# EAGLE design TeensyViewTopTest (EAGLE 7.5.0)
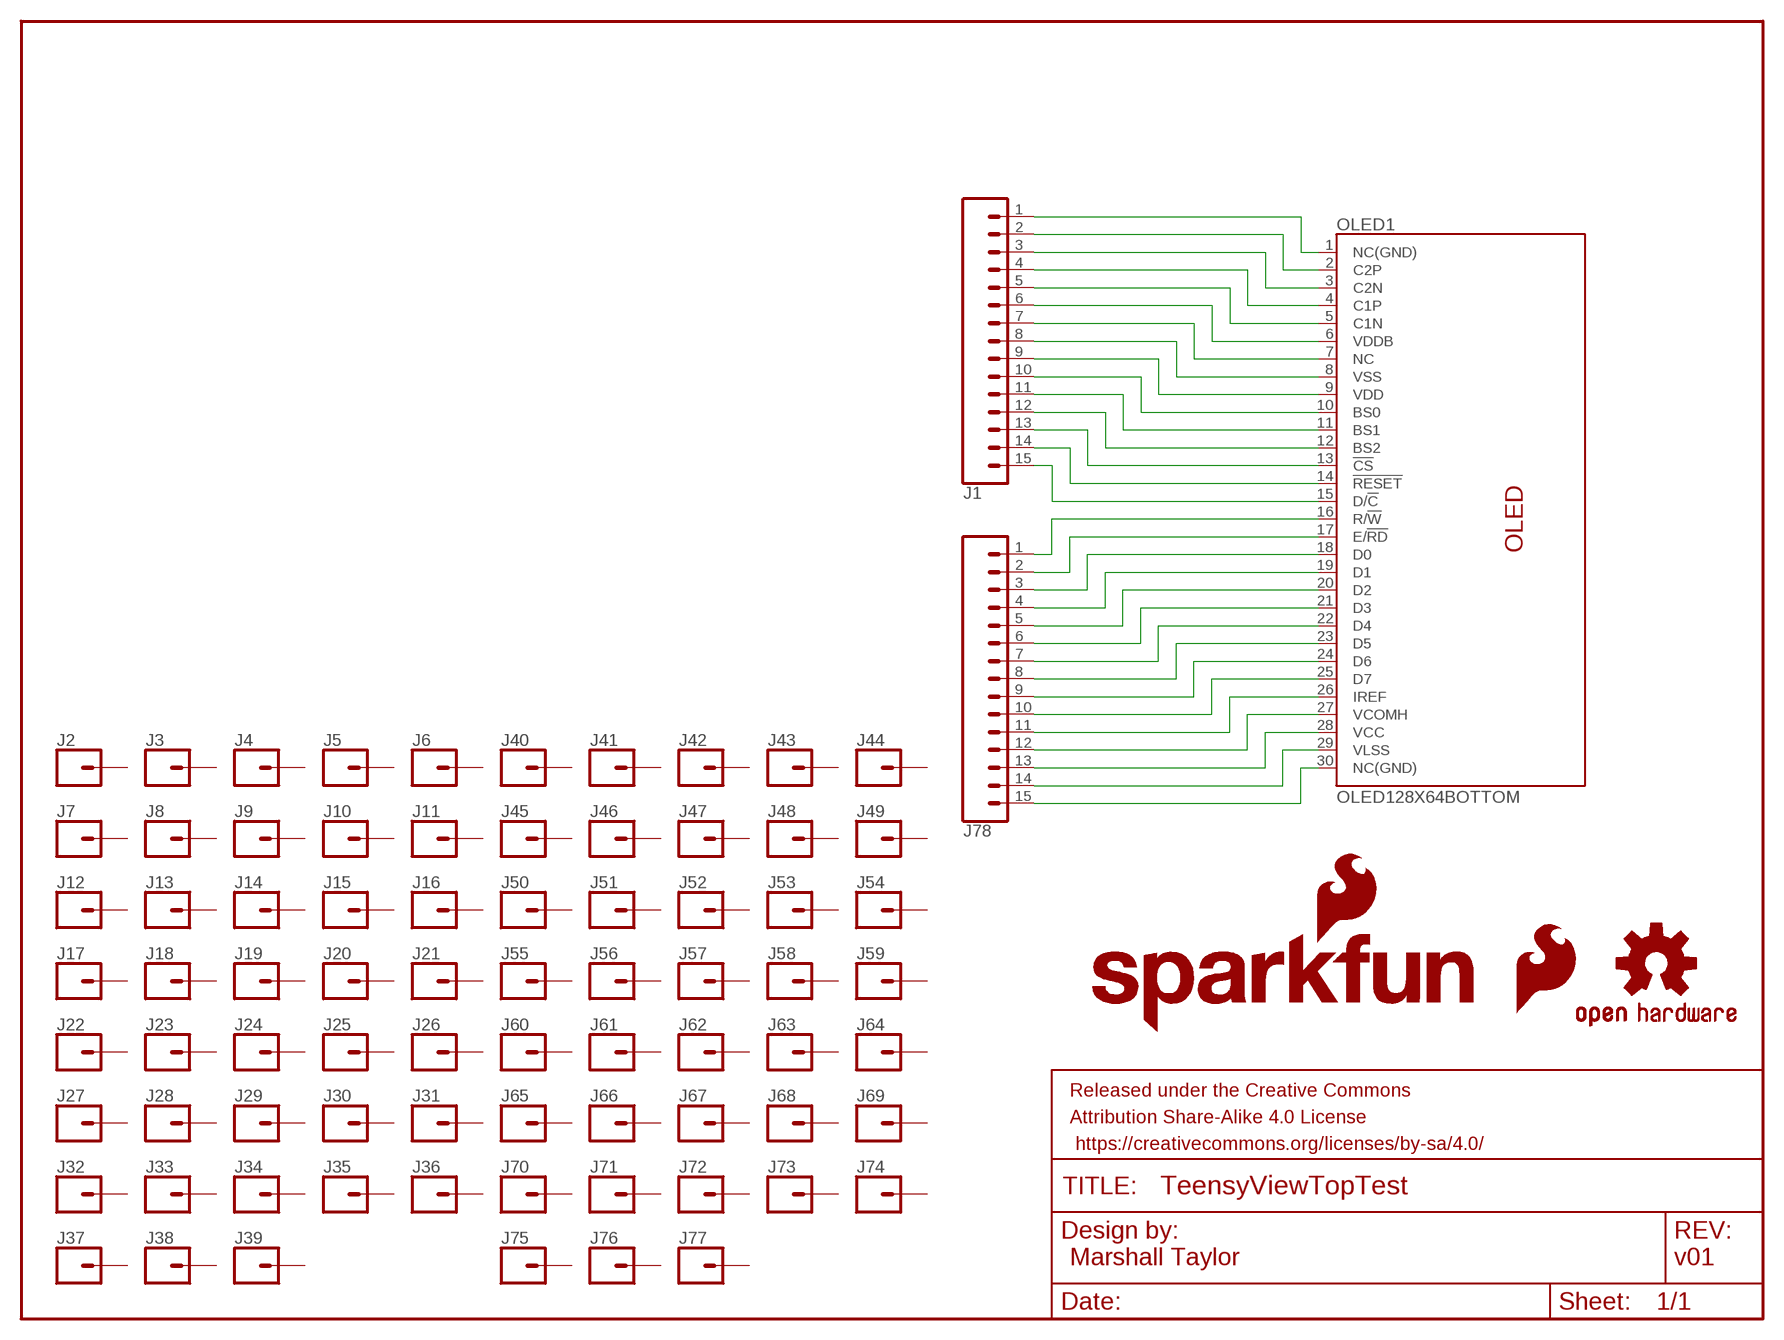
[diagram p0: schematic, sheet 1]

## Parts
FRAME1  FRAME-LETTER  [CREATIVE_COMMONS]
J1  CONN_15  [1X15]
J2  CONN_01PTH_NO_SILK_YES_STOP  [1X01_NO_SILK]
J3  CONN_01PTH_NO_SILK_YES_STOP  [1X01_NO_SILK]
J4  CONN_01PTH_NO_SILK_YES_STOP  [1X01_NO_SILK]
J5  CONN_01PTH_NO_SILK_YES_STOP  [1X01_NO_SILK]
J6  CONN_01PTH_NO_SILK_YES_STOP  [1X01_NO_SILK]
J7  CONN_01PTH_NO_SILK_YES_STOP  [1X01_NO_SILK]
J8  CONN_01PTH_NO_SILK_YES_STOP  [1X01_NO_SILK]
J9  CONN_01PTH_NO_SILK_YES_STOP  [1X01_NO_SILK]
J10  CONN_01PTH_NO_SILK_YES_STOP  [1X01_NO_SILK]
J11  CONN_01PTH_NO_SILK_YES_STOP  [1X01_NO_SILK]
J12  CONN_01PTH_NO_SILK_YES_STOP  [1X01_NO_SILK]
J13  CONN_01PTH_NO_SILK_YES_STOP  [1X01_NO_SILK]
J14  CONN_01PTH_NO_SILK_YES_STOP  [1X01_NO_SILK]
J15  CONN_01PTH_NO_SILK_YES_STOP  [1X01_NO_SILK]
J16  CONN_01PTH_NO_SILK_YES_STOP  [1X01_NO_SILK]
J17  CONN_01PTH_NO_SILK_YES_STOP  [1X01_NO_SILK]
J18  CONN_01PTH_NO_SILK_YES_STOP  [1X01_NO_SILK]
J19  CONN_01PTH_NO_SILK_YES_STOP  [1X01_NO_SILK]
J20  CONN_01PTH_NO_SILK_YES_STOP  [1X01_NO_SILK]
J21  CONN_01PTH_NO_SILK_YES_STOP  [1X01_NO_SILK]
J22  CONN_01PTH_NO_SILK_YES_STOP  [1X01_NO_SILK]
J23  CONN_01PTH_NO_SILK_YES_STOP  [1X01_NO_SILK]
J24  CONN_01PTH_NO_SILK_YES_STOP  [1X01_NO_SILK]
J25  CONN_01PTH_NO_SILK_YES_STOP  [1X01_NO_SILK]
J26  CONN_01PTH_NO_SILK_YES_STOP  [1X01_NO_SILK]
J27  CONN_01PTH_NO_SILK_YES_STOP  [1X01_NO_SILK]
J28  CONN_01PTH_NO_SILK_YES_STOP  [1X01_NO_SILK]
J29  CONN_01PTH_NO_SILK_YES_STOP  [1X01_NO_SILK]
J30  CONN_01PTH_NO_SILK_YES_STOP  [1X01_NO_SILK]
J31  CONN_01PTH_NO_SILK_YES_STOP  [1X01_NO_SILK]
J32  CONN_01PTH_NO_SILK_YES_STOP  [1X01_NO_SILK]
J33  CONN_01PTH_NO_SILK_YES_STOP  [1X01_NO_SILK]
J34  CONN_01PTH_NO_SILK_YES_STOP  [1X01_NO_SILK]
J35  CONN_01PTH_NO_SILK_YES_STOP  [1X01_NO_SILK]
J36  CONN_01PTH_NO_SILK_YES_STOP  [1X01_NO_SILK]
J37  CONN_01PTH_NO_SILK_YES_STOP  [1X01_NO_SILK]
J38  CONN_01PTH_NO_SILK_YES_STOP  [1X01_NO_SILK]
J39  CONN_01PTH_NO_SILK_YES_STOP  [1X01_NO_SILK]
J40  CONN_01PTH_NO_SILK_YES_STOP  [1X01_NO_SILK]
J41  CONN_01PTH_NO_SILK_YES_STOP  [1X01_NO_SILK]
J42  CONN_01PTH_NO_SILK_YES_STOP  [1X01_NO_SILK]
J43  CONN_01PTH_NO_SILK_YES_STOP  [1X01_NO_SILK]
J44  CONN_01PTH_NO_SILK_YES_STOP  [1X01_NO_SILK]
J45  CONN_01PTH_NO_SILK_YES_STOP  [1X01_NO_SILK]
J46  CONN_01PTH_NO_SILK_YES_STOP  [1X01_NO_SILK]
J47  CONN_01PTH_NO_SILK_YES_STOP  [1X01_NO_SILK]
J48  CONN_01PTH_NO_SILK_YES_STOP  [1X01_NO_SILK]
J49  CONN_01PTH_NO_SILK_YES_STOP  [1X01_NO_SILK]
J50  CONN_01PTH_NO_SILK_YES_STOP  [1X01_NO_SILK]
J51  CONN_01PTH_NO_SILK_YES_STOP  [1X01_NO_SILK]
J52  CONN_01PTH_NO_SILK_YES_STOP  [1X01_NO_SILK]
J53  CONN_01PTH_NO_SILK_YES_STOP  [1X01_NO_SILK]
J54  CONN_01PTH_NO_SILK_YES_STOP  [1X01_NO_SILK]
J55  CONN_01PTH_NO_SILK_YES_STOP  [1X01_NO_SILK]
J56  CONN_01PTH_NO_SILK_YES_STOP  [1X01_NO_SILK]
J57  CONN_01PTH_NO_SILK_YES_STOP  [1X01_NO_SILK]
J58  CONN_01PTH_NO_SILK_YES_STOP  [1X01_NO_SILK]
J59  CONN_01PTH_NO_SILK_YES_STOP  [1X01_NO_SILK]
J60  CONN_01PTH_NO_SILK_YES_STOP  [1X01_NO_SILK]
J61  CONN_01PTH_NO_SILK_YES_STOP  [1X01_NO_SILK]
J62  CONN_01PTH_NO_SILK_YES_STOP  [1X01_NO_SILK]
J63  CONN_01PTH_NO_SILK_YES_STOP  [1X01_NO_SILK]
J64  CONN_01PTH_NO_SILK_YES_STOP  [1X01_NO_SILK]
J65  CONN_01PTH_NO_SILK_YES_STOP  [1X01_NO_SILK]
J66  CONN_01PTH_NO_SILK_YES_STOP  [1X01_NO_SILK]
J67  CONN_01PTH_NO_SILK_YES_STOP  [1X01_NO_SILK]
J68  CONN_01PTH_NO_SILK_YES_STOP  [1X01_NO_SILK]
J69  CONN_01PTH_NO_SILK_YES_STOP  [1X01_NO_SILK]
J70  CONN_01PTH_NO_SILK_YES_STOP  [1X01_NO_SILK]
J71  CONN_01PTH_NO_SILK_YES_STOP  [1X01_NO_SILK]
J72  CONN_01PTH_NO_SILK_YES_STOP  [1X01_NO_SILK]
J73  CONN_01PTH_NO_SILK_YES_STOP  [1X01_NO_SILK]
J74  CONN_01PTH_NO_SILK_YES_STOP  [1X01_NO_SILK]
J75  CONN_01PTH_NO_SILK_YES_STOP  [1X01_NO_SILK]
J76  CONN_01PTH_NO_SILK_YES_STOP  [1X01_NO_SILK]
J77  CONN_01PTH_NO_SILK_YES_STOP  [1X01_NO_SILK]
J78  CONN_15  [1X15]
LOGO1  SFE_LOGO_FLAME.1_INCH  [SFE_LOGO_FLAME_.1]
LOGO2  OSHW-LOGOS  [OSHW-LOGO-S]
LOGO3  SFE_LOGO_NAME_FLAME.1_INCH  [SFE_LOGO_NAME_FLAME_.1]
OLED1  OLED128X64BOTTOM  [OLED-UG-2832HLBEG04]

## Nets
N$1: J1.1 OLED1.1(NC(GND))
N$2: J1.2 OLED1.2(C2P)
N$3: J1.3 OLED1.3(C2N)
N$4: J1.4 OLED1.4(C1P)
N$5: J1.5 OLED1.5(C1N)
N$6: J1.6 OLED1.6(VDDB)
N$7: J1.7 OLED1.7(NC)
N$8: J1.8 OLED1.8(VSS)
N$9: J1.9 OLED1.9(VDD)
N$10: J1.10 OLED1.10(BS0)
N$11: J1.11 OLED1.11(BS1)
N$12: J1.12 OLED1.12(BS2)
N$13: J1.13 OLED1.13(!CS!)
N$14: J1.14 OLED1.14(!RESET!)
N$15: J1.15 OLED1.15(D/!C!)
N$16: J78.1 OLED1.16(R/!W!)
N$17: J78.2 OLED1.17(E/!RD!)
N$18: J78.3 OLED1.18(D0)
N$19: J78.4 OLED1.19(D1)
N$20: J78.5 OLED1.20(D2)
N$21: J78.6 OLED1.21(D3)
N$22: J78.7 OLED1.22(D4)
N$23: J78.8 OLED1.23(D5)
N$24: J78.9 OLED1.24(D6)
N$25: J78.10 OLED1.25(D7)
N$26: J78.11 OLED1.26(IREF)
N$27: J78.12 OLED1.27(VCOMH)
N$28: J78.13 OLED1.28(VCC)
N$29: J78.14 OLED1.29(VLSS)
N$30: J78.15 OLED1.30(NC(GND))
Unconnected: J2.1 J3.1 J4.1 J5.1 J6.1 J7.1 J8.1 J9.1 J10.1 J11.1 J12.1 J13.1 J14.1 J15.1 J16.1 J17.1 J18.1 J19.1 J20.1 J21.1 J22.1 J23.1 J24.1 J25.1 J26.1 J27.1 J28.1 J29.1 J30.1 J31.1 J32.1 J33.1 J34.1 J35.1 J36.1 J37.1 J38.1 J39.1 J40.1 J41.1 J42.1 J43.1 J44.1 J45.1 J46.1 J47.1 J48.1 J49.1 J50.1 J51.1 J52.1 J53.1 J54.1 J55.1 J56.1 J57.1 J58.1 J59.1 J60.1 J61.1 J62.1 J63.1 J64.1 J65.1 J66.1 J67.1 J68.1 J69.1 J70.1 J71.1 J72.1 J73.1 J74.1 J75.1 J76.1 J77.1

## Notes on the sheet
- Marshall Taylor | v01

## Library data of the parts
FRAME1 = SparkFun-Aesthetics:FRAME-LETTER: Schematic Frame - Letter Standard 8.5x11 US Letter frame
J1 J78 = SparkFun-Connectors:CONN_15: Multi connection point. Often used as Generic Header-pin footprint for 0.1 inch spaced/style header connections On any of the 0.1 inch spaced packages, you can populate with these: Break Away Headers - Straight <https://www.sparkfun.com/products/116> (PRT-00116) Break Away Male Headers - Right Angle <https://www.sparkfun.com/products/553> (PRT-00553) Female Headers <https://www.sparkfun.com/products/115> (PRT-00115) Break Away Headers - Machine Pin <https://www.sparkfun.com/products/117> (PRT-00117) Break Away Female Headers - Swiss Machine Pin <https://www.sparkfun.com/products/743> (PRT-00743) For SCREWTERMINALS and SPRING TERMINALS visit here: Screw Terimnals on SparkFun.com <https://www.sparkfun.com/search/results?term=Screw+Terminals> (5mm/3.5mm/2.54mm spacing) This device is also useful as a general connection point to wire up your design to another part of your project. Our various solder wires solder well into these plated through hole pads. Hook-Up Wire - Assortment (Stranded, 22 AWG) <https://www.sparkfun.com/products/11375> (PRT-11375) Hook-Up Wire - Assortment (Solid Core, 22 AWG) <https://www.sparkfun.com/products/11367> (PRT-11367) View the entire wire category on our website here <https://www.sparkfun.com/categories/141> Special notes: Molex polarized connector foot print use with SKU : PRT-08231 with associated crimp pins and housings. 1MM SMD Version SKU: PRT-10208 NOTES ON THE VARIANTS LOCK and LOCK_LONGPADS... This footprint was designed to help hold the alignment of a through-hole component (i.e. 6-pin header) while soldering it into place. You may notice that each hole has been shifted either up or down by 0.005 of an inch from it's more standard position (which is a perfectly straight line). This slight alteration caused the pins (the squares in the middle) to touch the edges of the holes. Because they are alternating, it causes a "brace" to hold the component in place. 0.005 has proven to be the perfect amount of "off-center" position when using our standard breakaway headers. Although looks a little odd when you look at the bare footprint, once you have a header in there, the alteration is very hard to notice. Also,if you push a header all the way into place, it is covered up entirely on the bottom side.
J2-J77 = SparkFun-Connectors:CONN_01: Single connection point. Often used as Generic Header-pin footprint for 0.1 inch spaced/style header connections On any of the 0.1 inch spaced packages, you can populate with these: Break Away Headers - Straight <https://www.sparkfun.com/products/116> (PRT-00116) Break Away Male Headers - Right Angle <https://www.sparkfun.com/products/553> (PRT-00553) Female Headers <https://www.sparkfun.com/products/115> (PRT-00115) Break Away Headers - Machine Pin <https://www.sparkfun.com/products/117> (PRT-00117) Break Away Female Headers - Swiss Machine Pin <https://www.sparkfun.com/products/743> (PRT-00743) This device is also useful as a general connection point to wire up your design to another part of your project. Our various solder wires solder well into these plated through hole pads. Hook-Up Wire - Assortment (Stranded, 22 AWG) <https://www.sparkfun.com/products/11375> (PRT-11375) Hook-Up Wire - Assortment (Solid Core, 22 AWG) <https://www.sparkfun.com/products/11367> (PRT-11367) View the entire wire category on our website here <https://www.sparkfun.com/categories/141> Special notes: SMTSO-256-ET is a "flush mount" nut for a 4-40 screw. We mostly use this on specialty testbeds; it is a nice way to connect hardware to your PCB at an adjustable hieght. Also note, the SNAP packages are for using a snappable style connector. We sell a baggie of snaps and they are also used on two LilyPad designs: Snap Assortment - 30 pack (male and female) <https://www.sparkfun.com/products/11347> (DEV-11347) LilyPad Arduino SimpleSnap <https://www.sparkfun.com/products/10941> (DEV-10941) LilyPad SimpleSnap Protoboard <https://www.sparkfun.com/products/10940> (DEV-10940)
LOGO1 = SparkFun-Aesthetics:SFE_LOGO_FLAME: SparkFun Flame Logo This is the SparkFun flame logo. The logo on the schematic will always be the same size; the package variant is the height of the flame. Default layer for the logo on the board is tSilk.
LOGO2 = SparkFun-Aesthetics:OSHW-LOGO: Open-Source Hardware (OSHW) Logo This logo indicates the piece of hardware it is found on incorporates a OSHW license and/or adheres to the definition of open source hardware found here: http://freedomdefined.org/OSHW
LOGO3 = SparkFun-Aesthetics:SFE_LOGO_NAME_FLAME: SparkFun Font Logo w/ Flame This is the SparkFun full logo. The logo on the schematic will always be the same size; the package variant is the height of the flame part of the logo. Default layer for the logo on the board is tSilk.
OLED1 = SparkFun-Displays:OLED128X64BOTTOM: Micro OLED TODO: Add description SparkFun Products: product <https://www.sparkfun.com/products/13003>

## Board
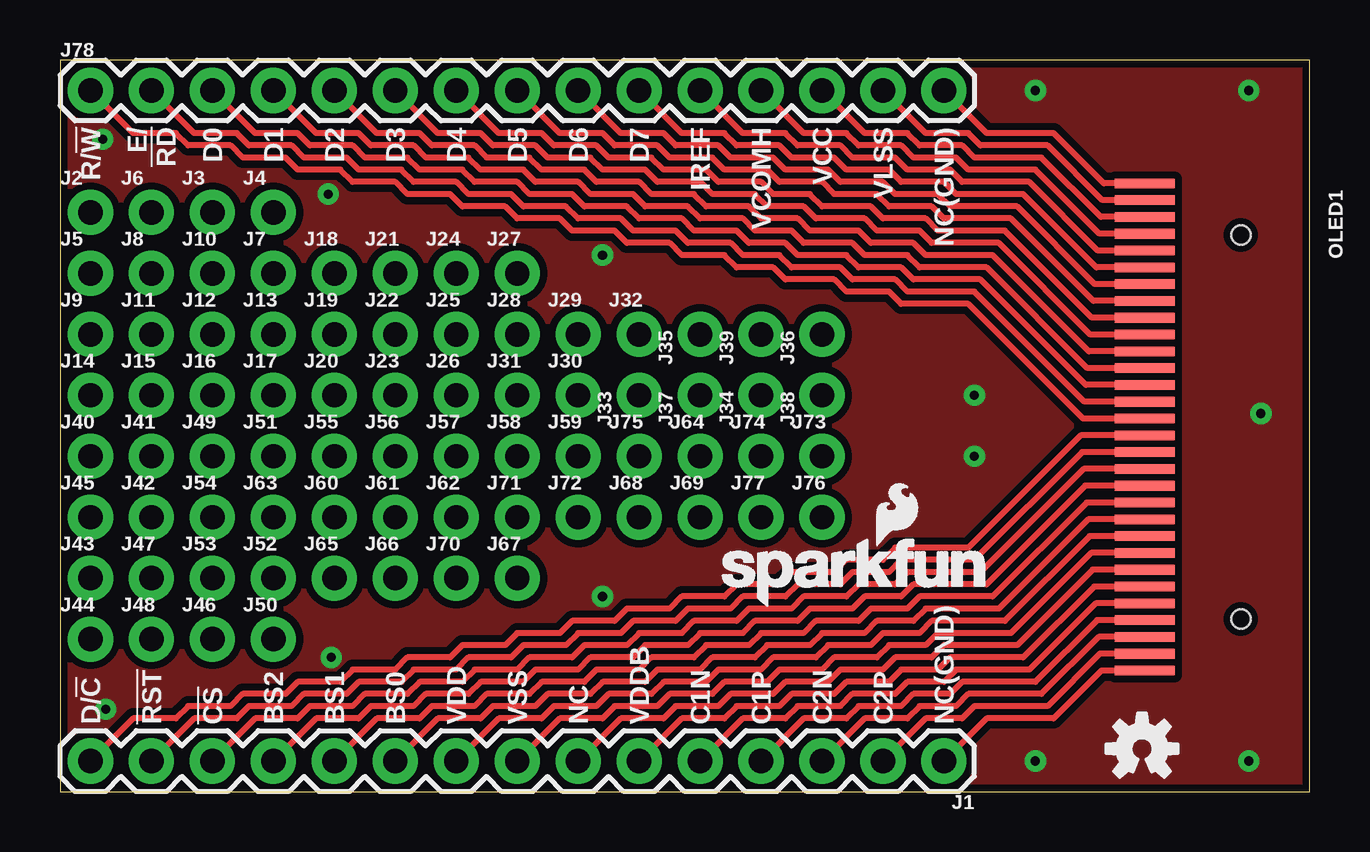
[diagram p1: board, top side]
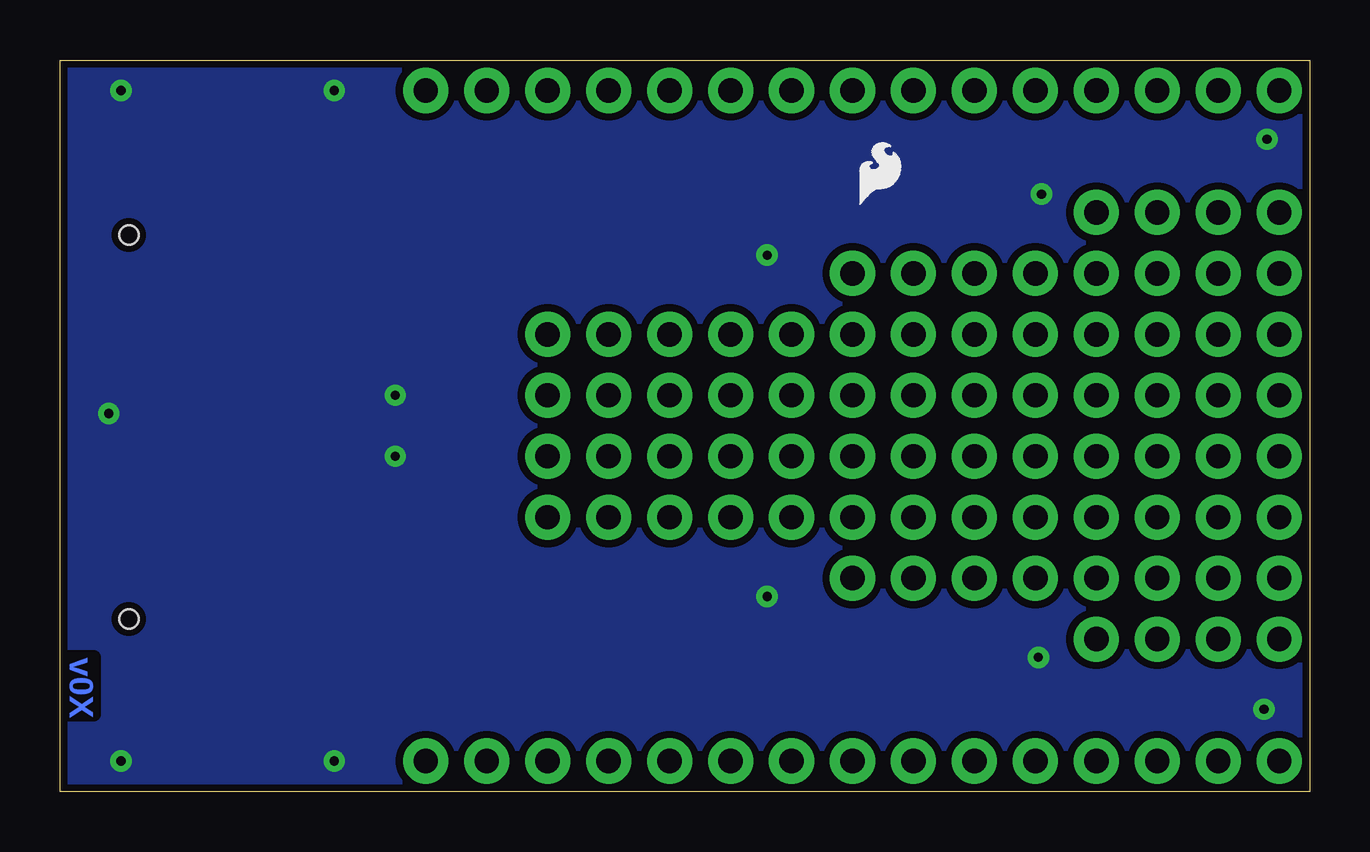
[diagram p2: board, bottom side, seen from below]

Size 52.07 x 30.48 mm. Coordinates in mm from the lower left corner, seen from the top.
Outline: 0,0 52.07,0 52.07,30.48 0,30.48 0,0
Copper layers (1*16): Top 0.035mm / dielectric 1.5mm / Bottom 0.035mm
Design rules "SparkFun-2-layer-STANDARD": minimum track width 10mil, minimum drill 20mil, track to track 10mil, track to pad 8mil, pad to pad 8mil, via to via 10mil, smd to smd 8mil, copper to edge 8mil, drill to drill 8mil, minimum pad ring 10mil, minimum via ring 10mil, stop-mask expansion 4mil, vias tented up to drill 25mil, thermal gap 10mil

### Footprints (pad centres in the part's own frame; a part is rotated, then mirrored left to right if it is on the bottom)
1X15 = drill 1.016 pad 1.88: 1 0,0; 2 2.54,0; 3 5.08,0; 4 7.62,0; 5 10.16,0; 6 12.7,0; 7 15.24,0; 8 17.78,0; 9 20.32,0; 10 22.86,0; 11 25.4,0; 12 27.94,0; 13 30.48,0; 14 33.02,0; 15 35.56,0
1X01_NO_SILK = drill 1.016 pad 1.88: 1 0,0
OLED-UG-2832HLBEG04 = smd 0.4 x 2.5: 1 0.85,-0.75; 2 1.55,-0.75; 3 2.25,-0.75; 4 2.95,-0.75; 5 3.65,-0.75; 6 4.35,-0.75; 7 5.05,-0.75; 8 5.75,-0.75; 9 6.45,-0.75; 10 7.15,-0.75; 11 7.85,-0.75; 12 8.55,-0.75; 13 9.25,-0.75; 14 9.95,-0.75; 15 10.65,-0.75; 16 11.35,-0.75; 17 12.05,-0.75; 18 12.75,-0.75; 19 13.45,-0.75; 20 14.15,-0.75; 21 14.85,-0.75; 22 15.55,-0.75; 23 16.25,-0.75; 24 16.95,-0.75; 25 17.65,-0.75; 26 18.35,-0.75; 27 19.05,-0.75; 28 19.75,-0.75; 29 20.45,-0.75; 30 21.15,-0.75 | hole 0.8: 19,-4.75; 3,-4.75

### Placement (x,y rotation side)
FRAME1  -3.81,-11.43 0 top  (outside the outline)
J1  36.83,1.27 180 top
J2  1.27,24.13 0 top
J3  6.35,24.13 0 top
J4  8.89,24.13 0 top
J5  1.27,21.59 0 top
J6  3.81,24.13 0 top
J7  8.89,21.59 0 top
J8  3.81,21.59 0 top
J9  1.27,19.05 0 top
J10  6.35,21.59 0 top
J11  3.81,19.05 0 top
J12  6.35,19.05 0 top
J13  8.89,19.05 0 top
J14  1.27,16.51 0 top
J15  3.81,16.51 0 top
J16  6.35,16.51 0 top
J17  8.89,16.51 0 top
J18  11.43,21.59 0 top
J19  11.43,19.05 0 top
J20  11.43,16.51 0 top
J21  13.97,21.59 0 top
J22  13.97,19.05 0 top
J23  13.97,16.51 0 top
J24  16.51,21.59 0 top
J25  16.51,19.05 0 top
J26  16.51,16.51 0 top
J27  19.05,21.59 0 top
J28  19.05,19.05 0 top
J29  21.59,19.05 0 top
J30  21.59,16.51 0 top
J31  19.05,16.51 0 top
J32  24.13,19.05 0 top
J33  24.13,16.51 90 top
J34  29.21,16.51 90 top
J35  26.67,19.05 90 top
J36  31.75,19.05 90 top
J37  26.67,16.51 90 top
J38  31.75,16.51 90 top
J39  29.21,19.05 90 top
J40  1.27,13.97 0 top
J41  3.81,13.97 0 top
J42  3.81,11.43 0 top
J43  1.27,8.89 0 top
J44  1.27,6.35 0 top
J45  1.27,11.43 0 top
J46  6.35,6.35 0 top
J47  3.81,8.89 0 top
J48  3.81,6.35 0 top
J49  6.35,13.97 0 top
J50  8.89,6.35 0 top
J51  8.89,13.97 0 top
J52  8.89,8.89 0 top
J53  6.35,8.89 0 top
J54  6.35,11.43 0 top
J55  11.43,13.97 0 top
J56  13.97,13.97 0 top
J57  16.51,13.97 0 top
J58  19.05,13.97 0 top
J59  21.59,13.97 0 top
J60  11.43,11.43 0 top
J61  13.97,11.43 0 top
J62  16.51,11.43 0 top
J63  8.89,11.43 0 top
J64  26.67,13.97 0 top
J65  11.43,8.89 0 top
J66  13.97,8.89 0 top
J67  19.05,8.89 0 top
J68  24.13,11.43 0 top
J69  26.67,11.43 0 top
J70  16.51,8.89 0 top
J71  19.05,11.43 0 top
J72  21.59,11.43 0 top
J73  31.75,13.97 0 top
J74  29.21,13.97 0 top
J75  24.13,13.97 0 top
J76  31.75,11.43 0 top
J77  29.21,11.43 0 top
J78  1.27,29.21 0 top
LOGO1  19.05,24.13 0 bottom
LOGO2  45.09,1.78 0 top
LOGO3  27.18,7.62 0 top
OLED1  44.45,4.19 90 top

### Tracks (layer width: path | path; a pad name or v marks a point on that pad's centre or on a via)
GND  (via drill 0.38)
  other vias: 40.64,29.21 38.1,16.51 49.53,1.27 40.64,1.27 38.1,13.97 50.04,15.75 49.53,29.21 22.61,22.35 11.18,24.89 1.78,27.18 22.61,8.13 11.3,5.59 1.91,3.43
  pour Top (isolate 0.305): 0,30.48 52.07,30.48 52.07,0 0,0
  pour Bottom (isolate 0.305): 52.07,30.48 0,30.48 0,0 52.07,0
N$1
  Top 0.254: OLED1.1 43.4,5.04 41.4,3.05 38.61,3.05 J1.1
N$2
  Top 0.254: OLED1.2 43.33,5.74 41.15,3.56 38.1,3.56 37.59,3.05 36.07,3.05 J1.2
N$3
  Top 0.254: OLED1.3 43.27,6.44 40.89,4.06 37.85,4.06 37.34,3.56 35.81,3.56 35.31,3.05 33.53,3.05 J1.3
N$4
  Top 0.254: OLED1.4 43.21,7.14 40.64,4.57 37.59,4.57 37.08,4.06 35.56,4.06 35.05,3.56 33.27,3.56 32.77,3.05 30.99,3.05 J1.4
N$5
  Top 0.254: OLED1.5 43.15,7.84 40.39,5.08 37.34,5.08 36.83,4.57 35.31,4.57 34.8,4.06 33.02,4.06 32.51,3.56 30.73,3.56 30.23,3.05 28.45,3.05 J1.5
N$6
  Top 0.254: OLED1.6 43.09,8.54 40.13,5.59 37.08,5.59 36.58,5.08 35.05,5.08 34.54,4.57 32.77,4.57 32.26,4.06 30.48,4.06 29.97,3.56 28.19,3.56 27.69,3.05 25.91,3.05 J1.6
N$7
  Top 0.254: OLED1.7 43.02,9.24 39.88,6.1 36.83,6.1 36.32,5.59 34.8,5.59 34.29,5.08 32.51,5.08 32,4.57 30.23,4.57 29.72,4.06 27.94,4.06 27.43,3.56 25.65,3.56 25.15,3.05 23.37,3.05 J1.7
N$8
  Top 0.254: OLED1.8 42.96,9.94 39.62,6.6 36.58,6.6 36.07,6.1 34.54,6.1 34.04,5.59 32.26,5.59 31.75,5.08 29.97,5.08 29.46,4.57 27.69,4.57 27.18,4.06 25.4,4.06 24.89,3.56 23.11,3.56 22.61,3.05 20.83,3.05 J1.8
N$9
  Top 0.254: OLED1.9 42.9,10.64 39.37,7.11 36.32,7.11 35.81,6.6 34.29,6.6 33.78,6.1 32,6.1 31.5,5.59 29.72,5.59 29.21,5.08 27.43,5.08 26.92,4.57 25.15,4.57 24.64,4.06 22.86,4.06 22.35,3.56 20.57,3.56 20.07,3.05 18.29,3.05 J1.9
N$10
  Top 0.254: OLED1.10 42.84,11.34 39.12,7.62 36.07,7.62 35.56,7.11 34.04,7.11 33.53,6.6 31.75,6.6 31.24,6.1 29.46,6.1 28.96,5.59 27.18,5.59 26.67,5.08 24.89,5.08 24.38,4.57 22.61,4.57 22.1,4.06 20.32,4.06 19.81,3.56 18.03,3.56 17.53,3.05 15.75,3.05 J1.10
N$11
  Top 0.254: OLED1.11 42.77,12.04 38.86,8.13 35.81,8.13 35.31,7.62 33.78,7.62 33.27,7.11 31.5,7.11 30.99,6.6 29.21,6.6 28.7,6.1 26.92,6.1 26.42,5.59 24.64,5.59 24.13,5.08 22.35,5.08 21.84,4.57 20.07,4.57 19.56,4.06 17.78,4.06 17.27,3.56 15.49,3.56 14.99,3.05 13.21,3.05 J1.11
N$12
  Top 0.254: OLED1.12 42.71,12.74 38.61,8.64 35.56,8.64 35.05,8.13 33.53,8.13 33.02,7.62 31.24,7.62 30.73,7.11 28.96,7.11 28.45,6.6 26.67,6.6 26.16,6.1 24.38,6.1 23.88,5.59 22.1,5.59 21.59,5.08 19.81,5.08 19.3,4.57 17.53,4.57 17.02,4.06 15.24,4.06 14.73,3.56 12.95,3.56 12.45,3.05 10.67,3.05 J1.12
N$13
  Top 0.254: OLED1.13 42.65,13.44 38.35,9.14 35.31,9.14 34.8,8.64 33.27,8.64 32.77,8.13 30.99,8.13 30.48,7.62 28.7,7.62 28.19,7.11 26.42,7.11 25.91,6.6 24.13,6.6 23.62,6.1 21.84,6.1 21.34,5.59 19.56,5.59 19.05,5.08 17.27,5.08 16.76,4.57 14.99,4.57 14.48,4.06 12.7,4.06 12.19,3.56 10.41,3.56 9.91,3.05 8.13,3.05 J1.13
N$14
  Top 0.254: OLED1.14 42.59,14.14 38.1,9.65 35.05,9.65 34.54,9.14 33.02,9.14 32.51,8.64 30.73,8.64 30.23,8.13 28.45,8.13 27.94,7.62 26.16,7.62 25.65,7.11 23.88,7.11 23.37,6.6 21.59,6.6 21.08,6.1 19.3,6.1 18.8,5.59 17.02,5.59 16.51,5.08 14.73,5.08 14.22,4.57 12.45,4.57 11.94,4.06 10.16,4.06 9.65,3.56 7.87,3.56 7.37,3.05 5.59,3.05 J1.14
N$15
  Top 0.254: OLED1.15 42.53,14.84 37.85,10.16 34.8,10.16 34.29,9.65 32.77,9.65 32.26,9.14 30.48,9.14 29.97,8.64 28.19,8.64 27.69,8.13 25.91,8.13 25.4,7.62 23.62,7.62 23.11,7.11 21.34,7.11 20.83,6.6 19.05,6.6 18.54,6.1 16.76,6.1 16.26,5.59 14.48,5.59 13.97,5.08 12.19,5.08 11.68,4.57 9.91,4.57 9.4,4.06 7.62,4.06 7.11,3.56 5.33,3.56 4.83,3.05 3.05,3.05 J1.15
N$16
  Top 0.254: OLED1.16 42.62,15.54 37.85,20.32 35.05,20.32 34.54,20.83 32.77,20.83 32.26,21.34 30.23,21.34 29.72,21.84 28.19,21.84 27.69,22.35 25.91,22.35 25.4,22.86 23.62,22.86 23.11,23.37 21.34,23.37 20.83,23.88 19.05,23.88 18.54,24.38 16.76,24.38 16.26,24.89 14.48,24.89 13.97,25.4 12.19,25.4 11.68,25.91 9.91,25.91 9.4,26.42 7.62,26.42 7.11,26.92 5.33,26.92 4.83,27.43 3.05,27.43 J78.1
N$17
  Top 0.254: OLED1.17 42.69,16.24 38.1,20.83 35.31,20.83 34.8,21.34 33.02,21.34 32.51,21.84 30.48,21.84 29.97,22.35 28.45,22.35 27.94,22.86 26.16,22.86 25.65,23.37 23.88,23.37 23.37,23.88 21.59,23.88 21.08,24.38 19.3,24.38 18.8,24.89 17.02,24.89 16.51,25.4 14.73,25.4 14.22,25.91 12.45,25.91 11.94,26.42 10.16,26.42 9.65,26.92 7.87,26.92 7.37,27.43 5.59,27.43 J78.2
N$18
  Top 0.254: OLED1.18 42.75,16.94 38.35,21.34 35.56,21.34 35.05,21.84 33.27,21.84 32.77,22.35 30.73,22.35 30.23,22.86 28.7,22.86 28.19,23.37 26.42,23.37 25.91,23.88 24.13,23.88 23.62,24.38 21.84,24.38 21.34,24.89 19.56,24.89 19.05,25.4 17.27,25.4 16.76,25.91 14.99,25.91 14.48,26.42 12.7,26.42 12.19,26.92 10.41,26.92 9.91,27.43 8.13,27.43 J78.3
N$19
  Top 0.254: OLED1.19 42.81,17.64 38.61,21.84 35.81,21.84 35.31,22.35 33.53,22.35 33.02,22.86 30.99,22.86 30.48,23.37 28.96,23.37 28.45,23.88 26.67,23.88 26.16,24.38 24.38,24.38 23.88,24.89 22.1,24.89 21.59,25.4 19.81,25.4 19.3,25.91 17.53,25.91 17.02,26.42 15.24,26.42 14.73,26.92 12.95,26.92 12.45,27.43 10.67,27.43 J78.4
N$20
  Top 0.254: OLED1.20 42.87,18.34 38.86,22.35 36.07,22.35 35.56,22.86 33.78,22.86 33.27,23.37 31.24,23.37 30.73,23.88 29.21,23.88 28.7,24.38 26.92,24.38 26.42,24.89 24.64,24.89 24.13,25.4 22.35,25.4 21.84,25.91 20.07,25.91 19.56,26.42 17.78,26.42 17.27,26.92 15.49,26.92 14.99,27.43 13.21,27.43 J78.5
N$21
  Top 0.254: OLED1.21 42.94,19.04 39.12,22.86 36.32,22.86 35.81,23.37 34.04,23.37 33.53,23.88 31.5,23.88 30.99,24.38 29.46,24.38 28.96,24.89 27.18,24.89 26.67,25.4 24.89,25.4 24.38,25.91 22.61,25.91 22.1,26.42 20.32,26.42 19.81,26.92 18.03,26.92 17.53,27.43 15.75,27.43 J78.6
N$22
  Top 0.254: OLED1.22 43,19.74 39.37,23.37 36.58,23.37 36.07,23.88 34.29,23.88 33.78,24.38 31.75,24.38 31.24,24.89 29.72,24.89 29.21,25.4 27.43,25.4 26.92,25.91 25.15,25.91 24.64,26.42 22.86,26.42 22.35,26.92 20.57,26.92 20.07,27.43 18.29,27.43 J78.7
N$23
  Top 0.254: J78.8 20.83,27.43 22.61,27.43 23.11,26.92 24.89,26.92 25.4,26.42 27.18,26.42 27.69,25.91 29.46,25.91 29.97,25.4 31.75,25.4 32.26,24.89 34.04,24.89 34.54,24.38 36.32,24.38 36.83,23.88 39.62,23.88 43.06,20.44 OLED1.23
N$24
  Top 0.254: J78.9 23.37,27.43 25.15,27.43 25.65,26.92 27.43,26.92 27.94,26.42 29.72,26.42 30.23,25.91 32,25.91 32.51,25.4 34.29,25.4 34.8,24.89 36.58,24.89 37.08,24.38 39.88,24.38 43.12,21.14 OLED1.24
N$25
  Top 0.254: J78.10 25.91,27.43 27.69,27.43 28.19,26.92 29.97,26.92 30.48,26.42 32.26,26.42 32.77,25.91 34.54,25.91 35.05,25.4 36.83,25.4 37.34,24.89 40.13,24.89 43.18,21.84 OLED1.25
N$26
  Top 0.254: J78.11 28.45,27.43 30.23,27.43 30.73,26.92 32.51,26.92 33.02,26.42 34.8,26.42 35.31,25.91 37.08,25.91 37.59,25.4 40.39,25.4 43.24,22.54 OLED1.26
N$27
  Top 0.254: J78.12 30.99,27.43 32.77,27.43 33.27,26.92 35.05,26.92 35.56,26.42 37.34,26.42 37.85,25.91 40.64,25.91 43.31,23.24 OLED1.27
N$28
  Top 0.254: OLED1.28 43.37,23.94 40.89,26.42 38.1,26.42 37.59,26.92 35.81,26.92 35.31,27.43 33.53,27.43 J78.13
N$29
  Top 0.254: 34.8,29.21 J78.14 36.07,27.43 37.85,27.43 38.35,26.92 41.15,26.92 43.43,24.64 OLED1.29
N$30
  Top 0.254: OLED1.30 43.49,25.34 41.4,27.43 38.61,27.43 J78.15

### Text on the board
Bottom: v0X
tPlace: R/!W | E/ / !RD | D0 | D1 | D2 | D3 | D4 | D5 | D6 | D7 | IREF | VCOMH | VCC | VLSS | NC(GND) | D/!C | !RST | !CS | BS2 | BS1 | BS0 | VDD | VSS | NC | VDDB | C1N | C1P | C2N | C2P | NC(GND)
tDocu: Marshall Taylor